# Altium schematic sheet STM32FOC_AD_SCH.schdoc
size 293 x 188 mm
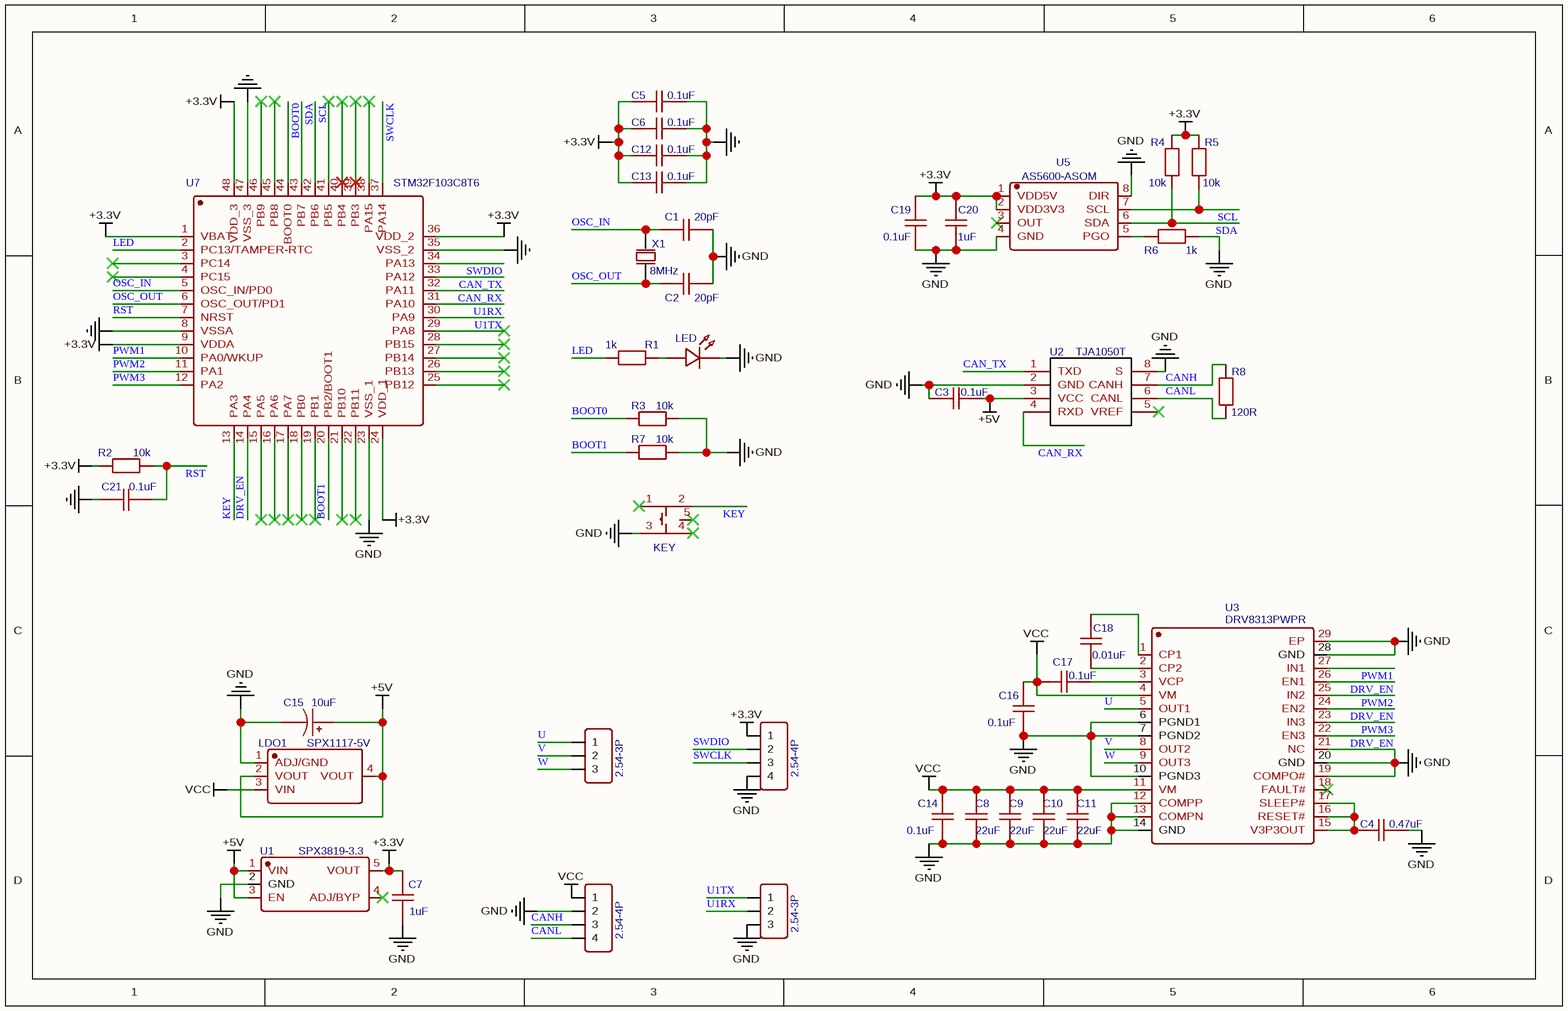
[diagram p0: STM32FOC_AD_SCH.schdoc]

## Parts
C1  20pF  [C0603]
C2  20pF  [C0603]
C3  0.1uF  [C0603]
C4  0.47uF  [C0603]
C5  0.1uF  [C0603]
C6  0.1uF  [C0603]
C7  1uF  [C0603]
C8  22uF  [C0805]
C9  22uF  [C0805]
C10  22uF  [C0805]
C11  22uF  [C0805]
C12  0.1uF  [C0603]
C13  0.1uF  [C0603]
C14  0.1uF  [C0603]
C15  10uF  [CASE-A_3216]
C16  0.1uF  [C0603]
C17  0.1uF  [C0603]
C18  0.01uF  [C0603]
C19  0.1uF  [C0603]
C20  1uF  [C0603]
C21  0.1uF  [C0603]
J1  2.54-4P  [HDR-M-2.54_1X4]
J2  2.54-3P  [HDR-M-2.54_1X3]
J3  2.54-3P  [HDR-M-2.54_1X3]
J4  2.54-4P  [HDR-M-2.54_1X4]
KEY  YTSA007A0152501B  [SW-SMD_4P-L3.4-W3.4-P2.00-LS4.0_TS3315A160GF]  (value not drawn)
LDO1  SPX1117-5V  [SOT-223-4_L6.5-W3.5-P2.30-LS7.0-BR]
LED  LED-0603_R  [LED0603_RED]  (value not drawn)
R1  1k  [R0603]
R2  10k  [R0603]
R3  10k  [R0603]
R4  10k  [R0603]
R5  10k  [R0603]
R6  1k  [R0603]
R7  10k  [R0603]
R8  120R  [R0603]
U1  SPX3819-3.3  [SOT-23-5_L2.9-W1.6-P0.95-LS2.8-BL]
U2  TJA1050T  [SOIC-8_L5.0-W4.0-P1.27-LS6.0-BL]
U3  DRV8313PWPR  [HTSSOP-28_L9.8-W4.5-P0.65-LS6.6-BL-EP]
U5  AS5600-ASOM  [SOIC-8_L5.0-W4.0-P1.27-LS6.0-BL]
U7  STM32F103C8T6  [STM-LQFP48]
X1  8MHz  [CRYSTAL-SMD_L5.0-W3.2]

## Nets
+3.3V: C5.1 C6.1 C7.2 C12.1 C13.1 C19.2 C20.2 J1.1 R2.1 R4.2 R5.2 U1.5(VOUT) U5.1(VDD5V) U5.2(VDD3V3) U7.1(VBAT) U7.9(VDDA) U7.24(VDD_1) U7.36(VDD_2) U7.48(VDD_3)
+5V: C3.2 C15.1 LDO1.2(VOUT) LDO1.4(VOUT) U1.1(VIN) U1.3(EN) U2.3(VCC)
GND: C1.2 C2.2 C3.1 C4.1 C5.2 C6.2 C7.1 C8.1 C9.1 C10.1 C11.1 C12.2 C13.2 C14.1 C15.2 C16.1 C19.1 C20.1 C21.1 J1.4 J2.3 J4.2 KEY.3 LDO1.1(ADJ/GND) LED.2 R3.2 R6.2 R7.1 U1.2(GND) U2.2(GND) U2.8(S) U3.6(PGND1) U3.7(PGND2) U3.10(PGND3) U3.12(COMPP) U3.13(COMPN) U3.14(GND) U3.19(COMPO#) U3.20(GND) U3.21(NC) U3.28(GND) U3.29(EP) U5.4(GND) U5.8(DIR) U7.8(VSSA) U7.23(VSS_1) U7.35(VSS_2) U7.47(VSS_3)
VCC: C8.2 C9.2 C10.2 C11.2 C14.2 C16.2 C17.2 J4.1 LDO1.3(VIN) U3.4(VM) U3.11(VM)
BOOT0: R3.1 U7.44(BOOT0)
BOOT1: R7.2 U7.20(PB2/BOOT1)
CAN_RX: U2.4(RXD) U7.32(PA11)
CAN_TX: U2.1(TXD) U7.33(PA12)
CANH: J4.3 R8.2 U2.7(CANH)
CANL: J4.4 R8.1 U2.6(CANL)
DRV_EN: U3.22(EN3) U3.24(EN2) U3.26(EN1) U7.14(PA4)
KEY: KEY.2 U7.13(PA3)
LED: R1.2 U7.2(PC13/TAMPER-RTC)
OSC_IN: C1.1 U7.5(OSC_IN/PD0) X1.2(OSC2)
OSC_OUT: C2.1 U7.6(OSC_OUT/PD1) X1.1(OSC1)
PWM1: U3.27(IN1) U7.10(PA0/WKUP)
PWM2: U3.25(IN2) U7.11(PA1)
PWM3: U3.23(IN3) U7.12(PA2)
RST: C21.2 R2.2 U7.7(NRST)
SCL: R5.1 U5.7(SCL) U7.42(PB6)
SDA: R4.1 U5.6(SDA) U7.43(PB7)
SWCLK: J1.3 U7.37(PA14)
SWDIO: J1.2 U7.34(PA13)
U: J3.1 U3.5(OUT1)
U1RX: J2.2 U7.31(PA10)
U1TX: J2.1 U7.30(PA9)
V: J3.2 U3.8(OUT2)
W: J3.3 U3.9(OUT3)
NetC4_2: C4.2 U3.15(V3P3OUT) U3.16(RESET#) U3.17(SLEEP#)
NetC17_1: C17.1 U3.3(VCP)
NetC18_1: C18.1 U3.2(CP2)
NetC18_2: C18.2 U3.1(CP1)
NetLED_1: LED.1 R1.1
NetR6_1: R6.1 U5.5(PGO)

Not connected (* = marked no-connect by the designer): KEY 1* 4* 5*; U1 4(ADJ/BYP)*; U2 5(VREF)*; U3 18(FAULT#)*; U5 3(OUT)*; U7 3(PC14)* 4(PC15)* 15(PA5)* 16(PA6)* 17(PA7)* 18(PB0)* 19(PB1)* 21(PB10)* 22(PB11)* 25(PB12)* 26(PB13)* 27(PB14)* 28(PB15)* 29(PA8)* 38(PA15)* 39(PB3)* 40(PB4)* 41(PB5)* 45(PB8)* 46(PB9)*

## Library data of the parts
C1 C2 = 20pF: nameAlias: Value(F); Contributor: LCEDA_Lib; spicePre: C; spiceSymbolName: C_0603_US
C3 C5 C6 C12-C14 C16 C17 C19 C21 = 0.1uF: nameAlias: Value(F); Contributor: LCEDA_Lib; spicePre: C; spiceSymbolName: C_0603_US
C4 = 0.47uF: nameAlias: Value(F); Contributor: LCEDA_Lib; spicePre: C; spiceSymbolName: C_0603_US
C7 C20 = 1uF: nameAlias: Value(F); Contributor: LCEDA_Lib; spicePre: C; spiceSymbolName: C_0603_US
C8-C11 = 22uF: nameAlias: Value(F); Contributor: LCEDA_Lib; spicePre: C; spiceSymbolName: C_0603_US
C15 = 10uF: nameAlias: Value(F); Contributor: LCEDA_Lib; spicePre: C; spiceSymbolName: C_Tan_SMD_A_US
C18 = 0.01uF: nameAlias: Value(F); Contributor: LCEDA_Lib; spicePre: C; spiceSymbolName: C_0603_US
J1 J4 = 2.54-4P: Contributor: LCEDA_Lib; BOM_Supplier Part: C124378; BOM_Supplier: LCSC; spicePre: J; spiceSymbolName: HDR-M-2.54_1x4
J2 J3 = 2.54-3P: Contributor: LCEDA_Lib; BOM_Supplier Part: C180248; BOM_Supplier: LCSC; spicePre: J; spiceSymbolName: HDR-M-2.54_1x3
KEY = YTSA007A0152501B: BOM_Manufacturer: DGBZ; Contributor: LCSC; BOM_Supplier: LCSC; BOM_Supplier Part: C967768; BOM_Manufacturer Part: YTSA007A0152501B; BOM_JLCPCB Part Class: Extended Part; spicePre: S; spiceSymbolName: YTSA007A0152501B
LDO1 = SPX1117-5V: BOM_Manufacturer: MaxLinear; BOM_Manufacturer Part: SPX1117M3-L/TR; BOM_Supplier: LCSC; BOM_Supplier Part: C67402; BOM_JLCPCB Part Class: Extended Part; spicePre: L; spiceSymbolName: SPX1117M3-L/TR
LED = LED-0603_R: BOM_Manufacturer: EVERLIGHT(台湾亿光); BOM_Manufacturer Part: 19-217/R6C-AL1M2VY/3T; Contributor: LCEDA_01; BOM_Supplier Part: C72044; BOM_Supplier: LCSC; spicePre: L; spiceSymbolName: LED-0603_R
R1 R6 = 1k: nameAlias: Value(Ω); Contributor: LCEDA_Lib; spicePre: R; spiceSymbolName: R_0603_EU
R2 R4 R5 = 10k: nameAlias: Value(Ω); Contributor: LCEDA_Lib; spicePre: R; spiceSymbolName: R_0603_EU
R3 R7 = 10k: nameAlias: Value(Ω); Contributor: LCEDA_Lib; Package Display: No; spicePre: R; spiceSymbolName: R_0402_EU
R8 = 120R: nameAlias: Value(Ω); Contributor: LCEDA_Lib; spicePre: R; spiceSymbolName: R_0603_EU
U1 = SPX3819-3.3: BOM_Manufacturer: null; BOM_Manufacturer Part: SPX3819M5-3.3; Contributor: lcsc; BOM_Supplier: LCSC; BOM_Supplier Part: C9900018941; BOM_JLCPCB Part Class: Extended Part; spicePre: U; spiceSymbolName: SPX3819M5-3.3
U2 = TJA1050T: BOM_Manufacturer: NXP(恩智浦); BOM_Manufacturer Part: TJA1050T/CM,118; BOM_Supplier: LCSC; BOM_Supplier Part: C6952; BOM_JLCPCB Part Class: Basic Part; spicePre: U; spiceSymbolName: TJA1050T/CM,118
U3 = DRV8313PWPR: BOM_Manufacturer: Texas Instruments; Contributor: LCSC; SMT Type: Extend; BOM_Supplier: LCSC; BOM_Supplier Part: C92482; BOM_Manufacturer Part: DRV8313PWPR; BOM_LCSC Assembly: Yes; spicePre: U; spiceSymbolName: DRV8313PWPR
U5 = AS5600-ASOM: BOM_Manufacturer: Ams; SMT Type: Extend; BOM_Supplier: LCSC; BOM_Manufacturer Part: AS5600-ASOM; BOM_Supplier Part: C79815; BOM_LCSC Assembly: Yes; spicePre: U; spiceSymbolName: AS5600-ASOM
U7 = STM32F103C8T6: sourceId: nsEecMmVT; spicePre: X; timeStamp: 1466642914; BOM_Manufacturer Part: ?
X1 = 8MHz: BOM_Manufacturer: YXC(扬兴晶振); BOM_Manufacturer Part: X50328MSB2GI; nameAlias: Frequency; BOM_Supplier: LCSC; BOM_Supplier Part: C115962; BOM_JLCPCB Part Class: Basic Part; spicePre: X; spiceSymbolName: X50328MSB2GI